# EAGLE schematic 8-STEP-SEQUENCER-1-2 (EAGLE 8.6.0)
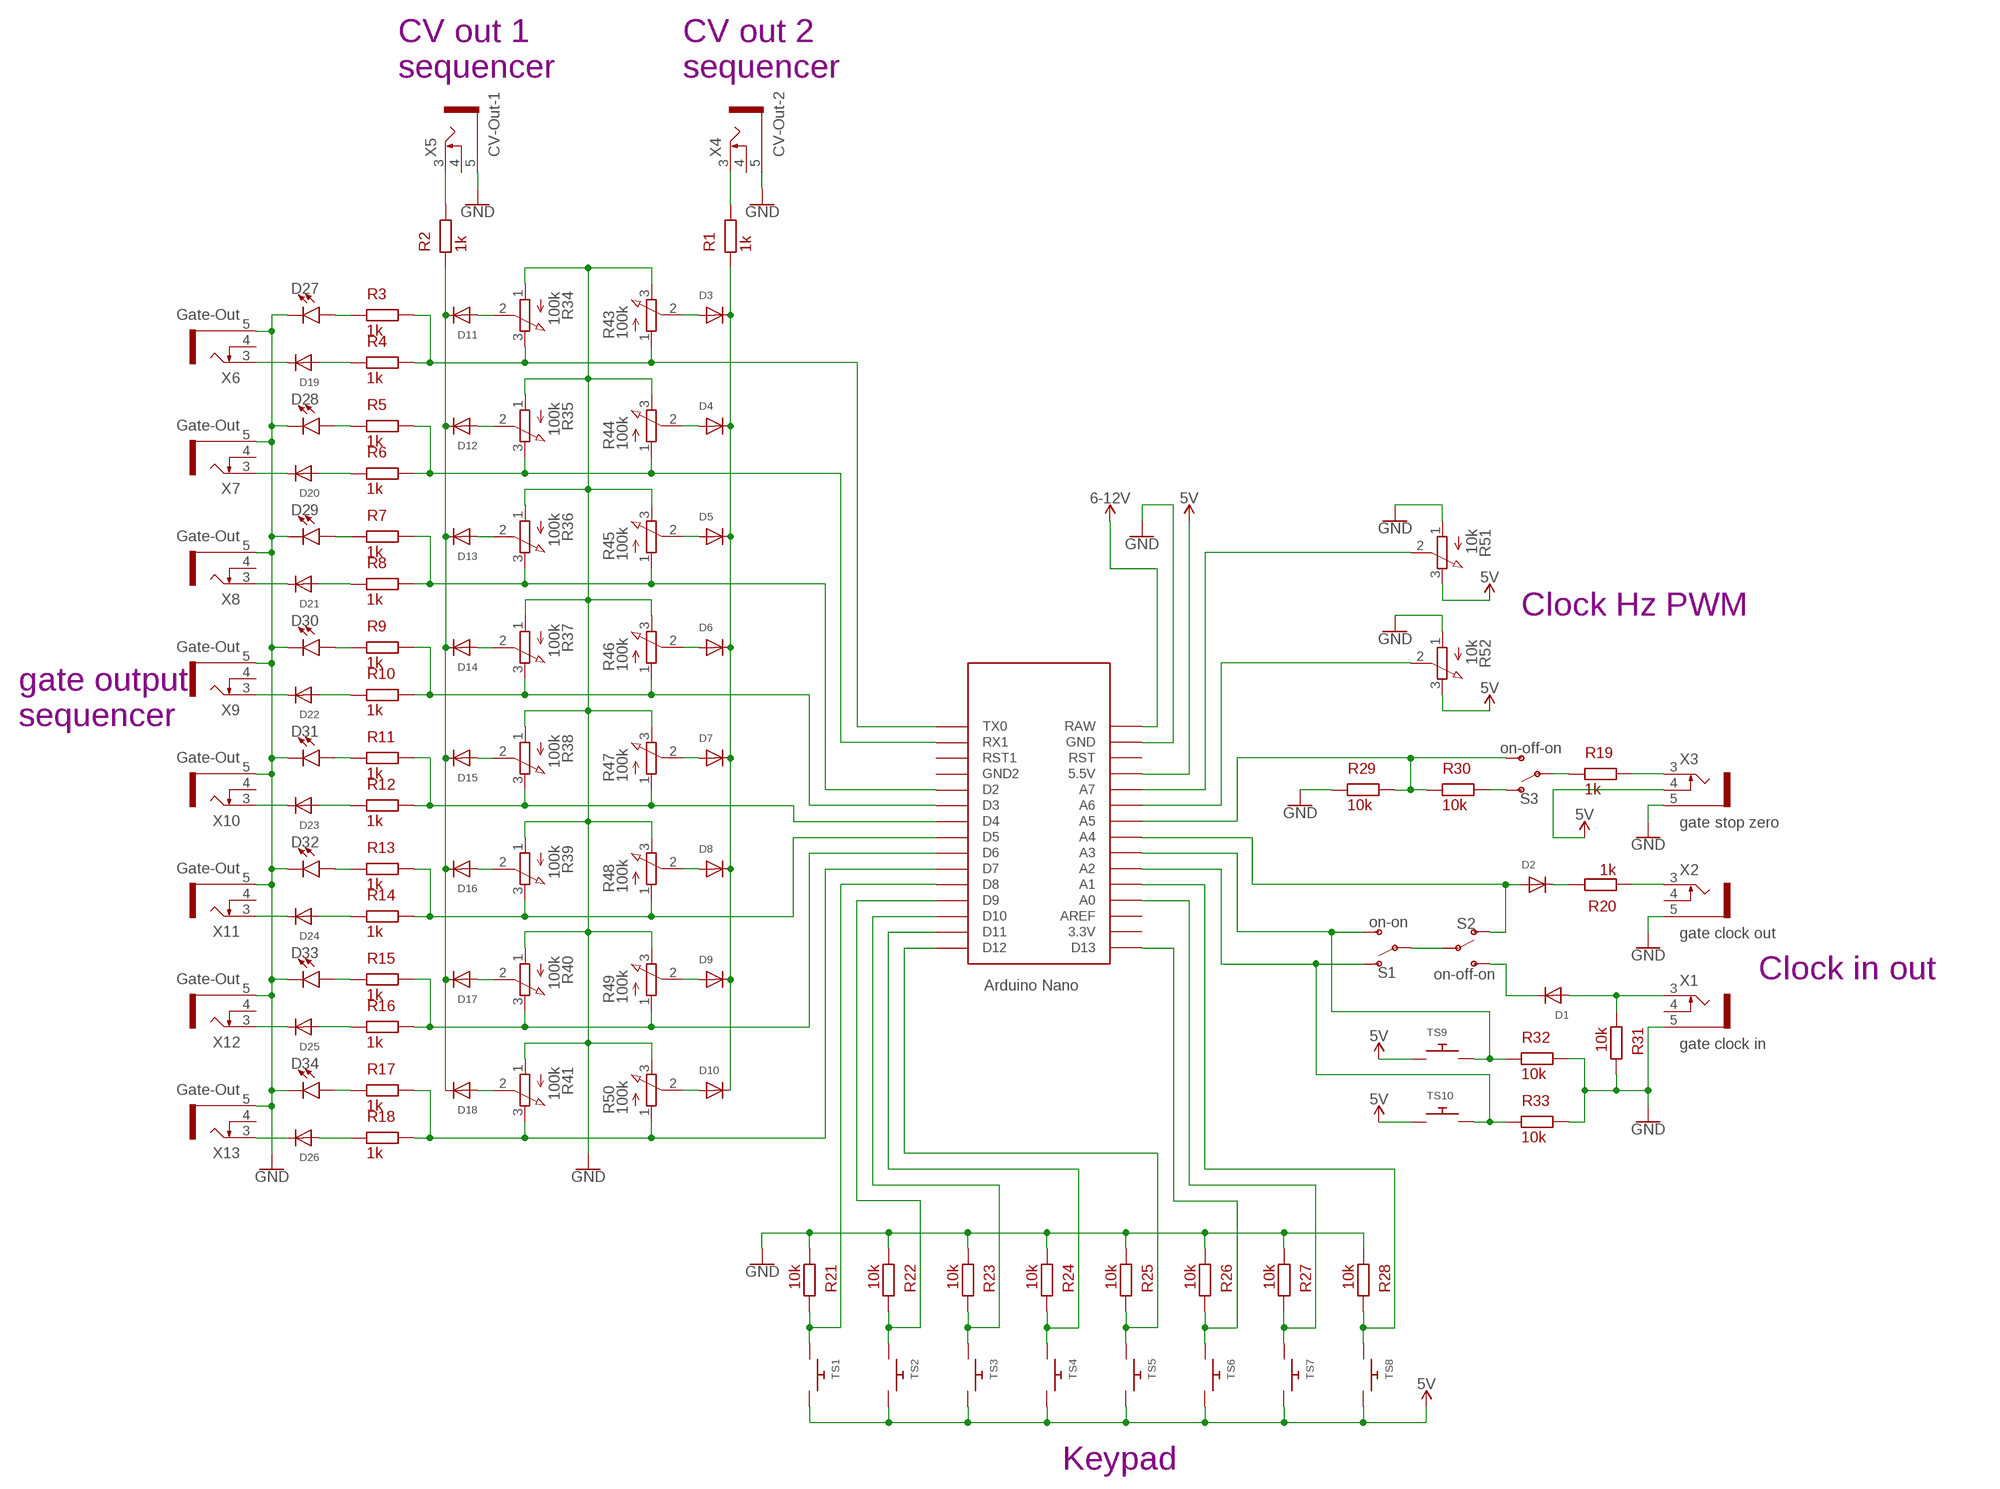
[diagram p0: schematic, sheet 1]

## Parts
D1  DIODEDO-1N4148  [DO-1N4148]
D2  DIODEDO-1N4148  [DO-1N4148]
D3  DIODEDO-1N4148  [DO-1N4148]
D4  DIODEDO-1N4148  [DO-1N4148]
D5  DIODEDO-1N4148  [DO-1N4148]
D6  DIODEDO-1N4148  [DO-1N4148]
D7  DIODEDO-1N4148  [DO-1N4148]
D8  DIODEDO-1N4148  [DO-1N4148]
D9  DIODEDO-1N4148  [DO-1N4148]
D10  DIODEDO-1N4148  [DO-1N4148]
D11  DIODEDO-1N4148  [DO-1N4148]
D12  DIODEDO-1N4148  [DO-1N4148]
D13  DIODEDO-1N4148  [DO-1N4148]
D14  DIODEDO-1N4148  [DO-1N4148]
D15  DIODEDO-1N4148  [DO-1N4148]
D16  DIODEDO-1N4148  [DO-1N4148]
D17  DIODEDO-1N4148  [DO-1N4148]
D18  DIODEDO-1N4148  [DO-1N4148]
D19  DIODEDO-1N4148  [DO-1N4148]
D20  DIODEDO-1N4148  [DO-1N4148]
D21  DIODEDO-1N4148  [DO-1N4148]
D22  DIODEDO-1N4148  [DO-1N4148]
D23  DIODEDO-1N4148  [DO-1N4148]
D24  DIODEDO-1N4148  [DO-1N4148]
D25  DIODEDO-1N4148  [DO-1N4148]
D26  DIODEDO-1N4148  [DO-1N4148]
D27  LED5MM  [LED_5MM]
D28  LED5MM  [LED_5MM]
D29  LED5MM  [LED_5MM]
D30  LED5MM  [LED_5MM]
D31  LED5MM  [LED_5MM]
D32  LED5MM  [LED_5MM]
D33  LED5MM  [LED_5MM]
D34  LED5MM  [LED_5MM]
R1  1k  R  (no package)
R2  1k  R  (no package)
R3  1k  R  (no package)
R4  1k  R  (no package)
R5  1k  R  (no package)
R6  1k  R  (no package)
R7  1k  R  (no package)
R8  1k  R  (no package)
R9  1k  R  (no package)
R10  1k  R  (no package)
R11  1k  R  (no package)
R12  1k  R  (no package)
R13  1k  R  (no package)
R14  1k  R  (no package)
R15  1k  R  (no package)
R16  1k  R  (no package)
R17  1k  R  (no package)
R18  1k  R  (no package)
R19  1k  R  (no package)
R20  1k  R  (no package)
R21  10k  R  (no package)
R22  10k  R  (no package)
R23  10k  R  (no package)
R24  10k  R  (no package)
R25  10k  R  (no package)
R26  10k  R  (no package)
R27  10k  R  (no package)
R28  10k  R  (no package)
R29  10k  R  (no package)
R30  10k  R  (no package)
R31  10k  R  (no package)
R32  10k  R  (no package)
R33  10k  R  (no package)
R34  100k  3RP/1610N  [3RP/1610N]
R35  100k  3RP/1610N  [3RP/1610N]
R36  100k  3RP/1610N  [3RP/1610N]
R37  100k  3RP/1610N  [3RP/1610N]
R38  100k  3RP/1610N  [3RP/1610N]
R39  100k  3RP/1610N  [3RP/1610N]
R40  100k  3RP/1610N  [3RP/1610N]
R41  100k  3RP/1610N  [3RP/1610N]
R43  100k  3RP/1610N  [3RP/1610N]
R44  100k  3RP/1610N  [3RP/1610N]
R45  100k  3RP/1610N  [3RP/1610N]
R46  100k  3RP/1610N  [3RP/1610N]
R47  100k  3RP/1610N  [3RP/1610N]
R48  100k  3RP/1610N  [3RP/1610N]
R49  100k  3RP/1610N  [3RP/1610N]
R50  100k  3RP/1610N  [3RP/1610N]
R51  10k  3RP/1610N  [3RP/1610N]
R52  10k  3RP/1610N  [3RP/1610N]
S1  on-on  SWITCH-SPDT-PTH-11.6X4.0MM-KIT  [SWITCH_SPDT_PTH_11.6X4.0MM_KIT]
S2  on-off-on  SWITCH-SPDT-PTH-11.6X4.0MM-KIT  [SWITCH_SPDT_PTH_11.6X4.0MM_KIT]
S3  on-off-on  SWITCH-SPDT-PTH-11.6X4.0MM-KIT  [SWITCH_SPDT_PTH_11.6X4.0MM_KIT]
TS1  SWITCH_PUSHBUTTONSOFTTOUCHSMD_SJ  [PUSHBUTTON_SMD_SJ]
TS2  SWITCH_PUSHBUTTONSOFTTOUCHSMD_SJ  [PUSHBUTTON_SMD_SJ]
TS3  SWITCH_PUSHBUTTONSOFTTOUCHSMD_SJ  [PUSHBUTTON_SMD_SJ]
TS4  SWITCH_PUSHBUTTONSOFTTOUCHSMD_SJ  [PUSHBUTTON_SMD_SJ]
TS5  SWITCH_PUSHBUTTONSOFTTOUCHSMD_SJ  [PUSHBUTTON_SMD_SJ]
TS6  SWITCH_PUSHBUTTONSOFTTOUCHSMD_SJ  [PUSHBUTTON_SMD_SJ]
TS7  SWITCH_PUSHBUTTONSOFTTOUCHSMD_SJ  [PUSHBUTTON_SMD_SJ]
TS8  SWITCH_PUSHBUTTONSOFTTOUCHSMD_SJ  [PUSHBUTTON_SMD_SJ]
TS9  SWITCH_PUSHBUTTONSOFTTOUCHSMD_SJ  [PUSHBUTTON_SMD_SJ]
TS10  SWITCH_PUSHBUTTONSOFTTOUCHSMD_SJ  [PUSHBUTTON_SMD_SJ]
U$1  NANO  [NANO]
X1  gate clock in  KLBR1  [KLBR1]
X2  gate clock out  KLBR1  [KLBR1]
X3  gate stop zero  KLBR1  [KLBR1]
X4  CV-Out-2  KLBR1  [KLBR1]
X5  CV-Out-1  KLBR1  [KLBR1]
X6  Gate-Out  KLBR1  [KLBR1]
X7  Gate-Out  KLBR1  [KLBR1]
X8  Gate-Out  KLBR1  [KLBR1]
X9  Gate-Out  KLBR1  [KLBR1]
X10  Gate-Out  KLBR1  [KLBR1]
X11  Gate-Out  KLBR1  [KLBR1]
X12  Gate-Out  KLBR1  [KLBR1]
X13  Gate-Out  KLBR1  [KLBR1]

## Nets
5V: R51.3(E) R52.3(E) TS1.P$2 TS2.P$2 TS3.P$2 TS4.P$2 TS5.P$2 TS6.P$2 TS7.P$2 TS8.P$2 TS9.P$1 TS10.P$1 U$1.5V(5.5V) U$1.RAW X3.4 ; supply symbol labelled 6-12V
GND: D27.K(C) D28.K(C) D29.K(C) D30.K(C) D31.K(C) D32.K(C) D33.K(C) D34.K(C) R21.1 R22.1 R23.1 R24.1 R25.1 R26.1 R27.1 R28.1 R29.1 R31.2 R32.2 R33.2 R34.1(A) R35.1(A) R36.1(A) R37.1(A) R38.1(A) R39.1(A) R40.1(A) R41.1(A) R43.3(E) R44.3(E) R45.3(E) R46.3(E) R47.3(E) R48.3(E) R49.3(E) R50.3(E) R51.1(A) R52.1(A) U$1.GND X1.5 X2.5 X3.5 X4.5 X5.5 X6.5 X7.5 X8.5 X9.5 X10.5 X11.5 X12.5 X13.5
N$2: R15.2 R16.2 R40.3(E) R49.1(A)
N$3: R26.2 TS6.P$1 U$1.D13
N$4: R17.2 R18.2 R41.3(E) R50.1(A)
N$5: R23.2 TS3.P$1 U$1.D10
N$6: R22.2 TS2.P$1 U$1.D9
N$7: R24.2 TS4.P$1 U$1.D11
N$8: R11.2 R12.2 R38.3(E) R47.1(A)
N$9: R28.2 TS8.P$1 U$1.A1
N$11: R25.2 TS5.P$1 U$1.D12
N$12: R21.2 TS1.P$1 U$1.D8
N$13: R27.2 TS7.P$1 U$1.A0
N$14: D1.C S2.3(S)
N$15: D1.A R31.1 X1.3
N$16: R32.1 S1.3(S) TS9.P$2 U$1.A3
N$17: D2.C R20.2
N$18: D2.A S2.1(O) U$1.A4
N$19: S1.2(P) S2.2(P)
N$20: R33.1 S1.1(O) TS10.P$2 U$1.A2
N$21: R52.2(S) U$1.A6
N$23: R20.1 X2.3
N$25: R19.1 S3.2(P)
N$26: R19.2 X3.3
N$27: R29.2 R30.1 S3.3(S) U$1.A5
N$28: R30.2 S3.1(O)
N$34: D11.A R34.2(S)
N$56: D12.A R35.2(S)
N$57: D13.A R36.2(S)
N$59: D14.A R37.2(S)
N$60: D15.A R38.2(S)
N$62: D16.A R39.2(S)
N$64: R51.2(S) U$1.A7
N$65: D17.A R40.2(S)
N$66: D18.A R41.2(S)
N$70: D3.A R43.2(S)
N$76: D4.A R44.2(S)
N$78: D5.A R45.2(S)
N$80: D6.A R46.2(S)
N$82: D7.A R47.2(S)
N$87: D8.A R48.2(S)
N$88: D9.A R49.2(S)
N$91: D10.A R50.2(S)
N$92: D11.C D12.C D13.C D14.C D15.C D16.C D17.C D18.C R2.1
N$93: D3.C D4.C D5.C D6.C D7.C D8.C D9.C D10.C R1.1
N$94: R2.2 X5.3
N$95: R1.2 X4.3
N$96: D21.C X8.3
N$97: D20.C X7.3
N$98: D19.C X6.3
N$99: D27.A R3.1
N$100: D28.A R5.1
N$101: D29.A R7.1
N$102: D30.A R9.1
N$103: D31.A R11.1
N$104: D32.A R13.1
N$105: D33.A R15.1
N$106: D34.A R17.1
N$107: D19.A R4.1
N$108: D20.A R6.1
N$109: D21.A R8.1
N$110: D22.A R10.1
N$111: D23.A R12.1
N$112: D24.A R14.1
N$113: D26.C X13.3
N$114: D26.A R18.1
N$115: D25.A R16.1
N$116: D25.C X12.3
N$117: D24.C X11.3
N$118: D22.C X9.3
N$119: D23.C X10.3
N$120: R3.2 R4.2 R34.3(E) R43.1(A) U$1.TX0
N$121: R5.2 R6.2 R35.3(E) R44.1(A) U$1.RX1
N$122: R7.2 R8.2 R36.3(E) R45.1(A)
N$123: R9.2 R10.2 R37.3(E) R46.1(A)
N$124: R13.2 R14.2 R39.3(E) R48.1(A)
Unconnected: U$1.3.3V U$1.AREF U$1.D2 U$1.D3 U$1.D4 U$1.D5 U$1.D6 U$1.D7 U$1.GND1(GND2) U$1.ICSP1 U$1.ICSP2 U$1.ICSP3 U$1.ICSP4 U$1.ICSP5 U$1.ICSP6 U$1.RST U$1.RST1 X1.4 X2.4 X4.4 X5.4 X6.4 X7.4 X8.4 X9.4 X10.4 X11.4 X12.4 X13.4

## Notes on the sheet
- CV out 1
  sequencer
- CV out 2
  sequencer
- Clock Hz PWM
- gate output 
  sequencer
- Clock in out
- Keypad

## Library data of the parts
D1-D26 = adafruit:DIODE: Diode SMADIODE - SMA Surface Mount Package 20V 1A Schottky Diode Digikey: 641-1014-6-ND DO-1N4148 - Through Hole Small Current Diode SOD-123 20V 1 A (.5mV Vf) Schottky Diode - Digikey: MBRX120TPMSCT-ND SOD-323 10V 570mA (.38mV Vf, 3ns) Schottky Diode - Digikey: ZLLS410CT-ND SOD-523 30V 30mA Schottky Diode (RB751S-40TE61) - Digikey: RB751S-40TE61CT-ND SOT23-R/W - SOT23 Package (R = Solder Paste/Reflow Ovens, W = Hand-Soldering) BAT54Film 40V 300mA - Digikey: 497-7162-1-ND
D27-D34 = SparkFun-LED:LED: LED (Generic) Standard schematic elements and footprints for 5mm, 3mm, 1206, and 0603 sized LEDs. Generic LEDs with no color specified.
R1-R33 = ngspice-simulation:R: RESISTOR
R34-R41 R43-R52 = pot:3RP/1610N: 16mm Potentiometer one level Source: http://www.alphapotentiometers.net/html/16mm_pot_2.html
S1-S3 = SparkFun-Switches:SWITCH-SPDT: Single Pole, Double Throw (SPDT) Switch Single-pole, double-throw (SPDT) switch. Variant Overview SMD-AYZ0202 Surface Mount DPDT Switch <https://www.sparkfun.com/products/597> (COM-00597) Used on e.g. LilyPad Arduino USB - ATmega32U4 Board <https://www.sparkfun.com/products/12049> PTH-11.6X4.0MM SPDT Mini Power Switch <https://www.sparkfun.com/products/102> (COM-00102) Used on e.g. SparkFun Simon Says - Through-Hole Soldering Kit <https://www.sparkfun.com/products/10547> (KIT-10547) PTH-11.6X4.0MM-KIT KIT version of SPDT Mini Power Switch - Simplifies soldering by removing tStop of switch pins - only one side can be soldered. PTH-11.6X4.0MM-LOCK LOCK version of SPDT Mini Power Switch - Offset pins hold switch in place for easier soldering. SMD-RIGHT-ANGLE Surface Mount Right Angle Switch <https://www.sparkfun.com/products/10860> (COM-10860) Used on e.g. SparkFun ESP8266 Thing <https://www.sparkfun.com/products/13231>; PROD_ID: SWCH-08261; SF_SKU: COM-00102
TS1-TS10 = adafruit:SWITCH_PUSHBUTTON: Buttons SOFTTOUCHSMD_SJ - Soft touch temporary push button (Super Junk Akihabara) Compatible with SKPMANE010 [Mouser: 688-SKPMAN] C&K_KSS = Digikey: KSS221GLFS
U$1 = Arduino-clone:NANO: Arduino Nano
X1-X13 = con-lumberg:KLBR?: Jack connectors according to JISC 6560, 2.5mm / 3.5 mm Klinkensteckverbinder nach JISC 6560, 2.5mm / 3,5 mm Source: http://www.lumberg.com/Produkte/PDFs/KLBR2.pdf www.lumberg.com/Produkte/PDFs/KLBR1.pdf; MPN: KLBR 1; OC_FARNELL: 1200140; OC_NEWARK: 97K2707

## Module KEYPAD
Ports: 

### Library data of the parts